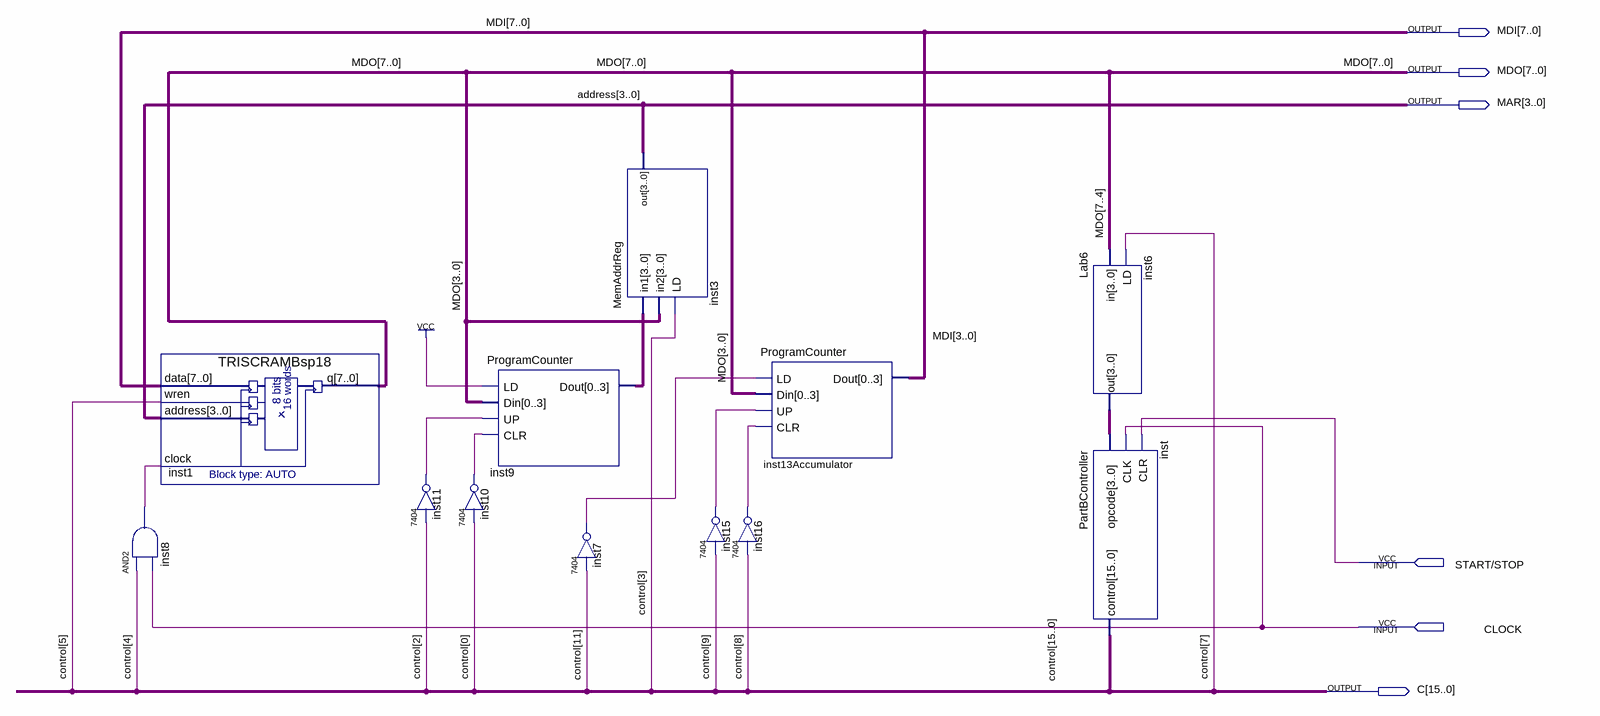
[diagram p0: schematic sheet]
// Quartus schematic PartB.bdf as structural Verilog: 12 symbols, 6 pins
module PartB (
  input  \START/STOP ,
  input  CLOCK,
  output [7:0] MDI,
  output [7:0] MDO,
  output [3:0] MAR,
  output [15:0] C
);

  wire inst7_1, inst8_out, inst10_1, inst11_1, inst15_1, inst16_1;
  wire [3:0] inst6_out, inst9_dout;

  and inst8 (inst8_out, C[4], CLOCK);
  TRISCRAMBsp18 inst1 (.data(MDI), .wren(C[5]), .address(MAR), .clock(inst8_out), .q(MDO));
  \7404  inst10 (.\2 (C[0]), .\1 (inst10_1));
  \7404  inst11 (.\2 (C[2]), .\1 (inst11_1));
  ProgramCounter inst9 (.LD(1'b1), .Din(MDO[3:0]), .UP(inst11_1), .CLR(inst10_1), .Dout(inst9_dout));
  \7404  inst7 (.\2 (C[11]), .\1 (inst7_1));
  MemAddrReg inst3 (.in1(inst9_dout), .in2(MDO[3:0]), .LD(C[3]), .out(MAR));
  \7404  inst15 (.\2 (C[9]), .\1 (inst15_1));
  ProgramCounter inst13Accumulator (.LD(inst7_1), .Din(MDO[3:0]), .UP(inst15_1), .CLR(inst16_1), .Dout(MDI[3:0]));
  \7404  inst16 (.\2 (C[8]), .\1 (inst16_1));
  Lab6 inst6 (.in(MDO[7:4]), .LD(C[7]), .out(inst6_out));
  PartBController inst (.opcode(inst6_out), .CLK(CLOCK), .CLR(\START/STOP ), .control(C));

  // Other names for the same wires on the sheet: address[3:0] = MAR; control[15:0] = C
endmodule
